# Altium schematic sheet measure.SchDoc
size 420 x 297 mm; SheetNumber: 5; SheetTotal: 5
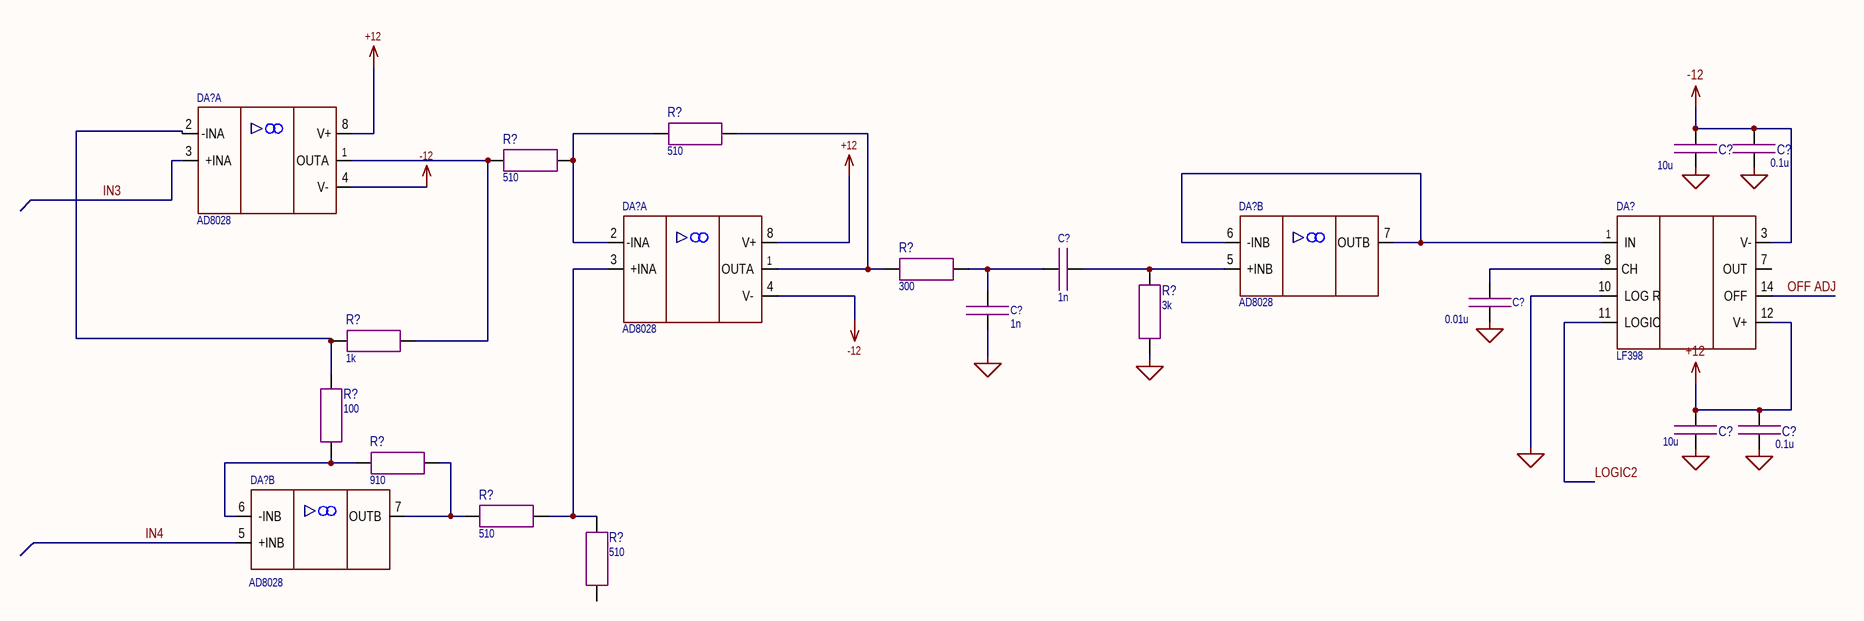
[diagram p0: measure.SchDoc]

## Parts
(Parts that share a designator on the sheet are numbered #1, #2 ... from top to bottom, then left to right.)
C?#1  10u  [CAP: SMD 0805 MD IPC 782]
C?#2  0.1u  [CAP: SMD 0805 MD IPC 782]
C?#3  1n
C?#4  0.01u  [CAP: SMD 0805 MD IPC 782]
C?#5  1n
C?#6  10u  [CAP: SMD 0805 MD IPC 782]
C?#7  0.1u  [CAP: SMD 0805 MD IPC 782]
DA?#1  AD8028  [IC: SOIC 8]  (part A of 2)
DA?#2  AD8028  [IC: SOIC 8]  (part A of 2)
DA?#3  AD8028  [IC: SOIC 8]  (part B of 2)
DA?#4  LF398  [IC: SOIC 14]
DA?#5  AD8028  [IC: SOIC 8]  (part B of 2)
R?#1  510  [RES: SMD 0805 MD IPC 782]
R?#2  510  [RES: SMD 0805 MD IPC 782]
R?#3  300  [RES: SMD 0805 MD IPC 782]
R?#4  3k  [RES: SMD 0805 MD IPC 782]
R?#5  1k  [RES: SMD 0805 MD IPC 782]
R?#6  100  [RES: SMD 0805 MD IPC 782]
R?#7  910  [RES: SMD 0805 MD IPC 782]
R?#8  510  [RES: SMD 0805 MD IPC 782]
R?#9  510  [RES: SMD 0805 MD IPC 782]

## Nets
+12: C?#6.1 C?#7.1 DA?#1.8(V+) DA?#2.8(V+) DA?#4.12(V+)
-12: C?#1.1 C?#2.1 DA?#1.4(V-) DA?#2.4(V-) DA?#4.3(V-)
NetC?#1_2: C?#1.2 C?#2.2 C?#4.2 C?#5.2 C?#6.2 C?#7.2 DA?#4.10(LOG_R) R?#4.2
IN3: DA?#1.3(+INA)
IN4: DA?#5.5(+INB)
LOGIC2: DA?#4.11(LOGIC)
OFF ADJ: DA?#4.14(OFF)
NetC?#3_1: C?#3.1 DA?#3.5(+INB) R?#4.1
NetC?#3_2: C?#3.2 C?#5.1 R?#3.2
NetC?#4_1: C?#4.1 DA?#4.8(CH)
NetDA?#1_1: DA?#1.1(OUTA) R?#2.1 R?#5.1
NetDA?#1_2: DA?#1.2(-INA) R?#5.2 R?#6.2
NetDA?#2_1: DA?#2.1(OUTA) R?#1.2 R?#3.1
NetDA?#2_2: DA?#2.2(-INA) R?#1.1 R?#2.2
NetDA?#2_3: DA?#2.3(+INA) R?#8.2 R?#9.2
NetDA?#3_6: DA?#3.6(-INB) DA?#3.7(OUTB) DA?#4.1(IN)
NetDA?#5_6: DA?#5.6(-INB) R?#6.1 R?#7.2
NetDA?#5_7: DA?#5.7(OUTB) R?#7.1 R?#8.1

Not connected (* = marked no-connect by the designer): DA?#4 7(OUT); R?#9 1

## Notes on the sheet
- Подп. и дата
- Инв. № дубл.
- Взам. инв. №
- Инв. № подл.
- Изм.
- Лист
- № докум.
- Подп.
- Дата
- 2.106-A3
- Копировал
- Формат А3

## Library data of the parts
C?#1 C?#6 = 10u 50V 0805 ±10%: Code: 6289735441; Name: Конденсатор 12065D106KAT2A, AVX
C?#2 C?#7 = 0.1u 50V 0805 ±10%: Code: 6279254871; Name: Конденсатор X7R 50V 0,1uF ±10% 0805
C?#3 C?#5 = 1n 50V 0603 ±5%
C?#4 = 0.01u 50V 0805 ±5%: Code: 6279261451; Name: Конденсатор X7R 50V  0,01uF±5%  0805
DA?#1-DA?#3 DA?#5 = AD8028_part
DA?#4 = LF398MX
R?#1 R?#2 R?#7-R?#9 = 510 ±1% 0805: Code: 6069137191; Name: Резистор 510R±1%  0805
R?#3 = 300 ±1%  0805: Code: 6094357025; Name: Резистор 300R±1%  0805
R?#4 = 3k ±1% 0805: Code: 6094357331; Name: Резистор 3К ±1% 0805
R?#5 = 1k ±1% 0805: Code: 6027158691; Name: Резистор RC0805FR-071KL, Yageo
R?#6 = 100 ±1%  0805: Code: 6094351171; Name: Резистор 100R±1%  0805